# Altium schematic sheet 4.SchDoc
size 420 x 297 mm
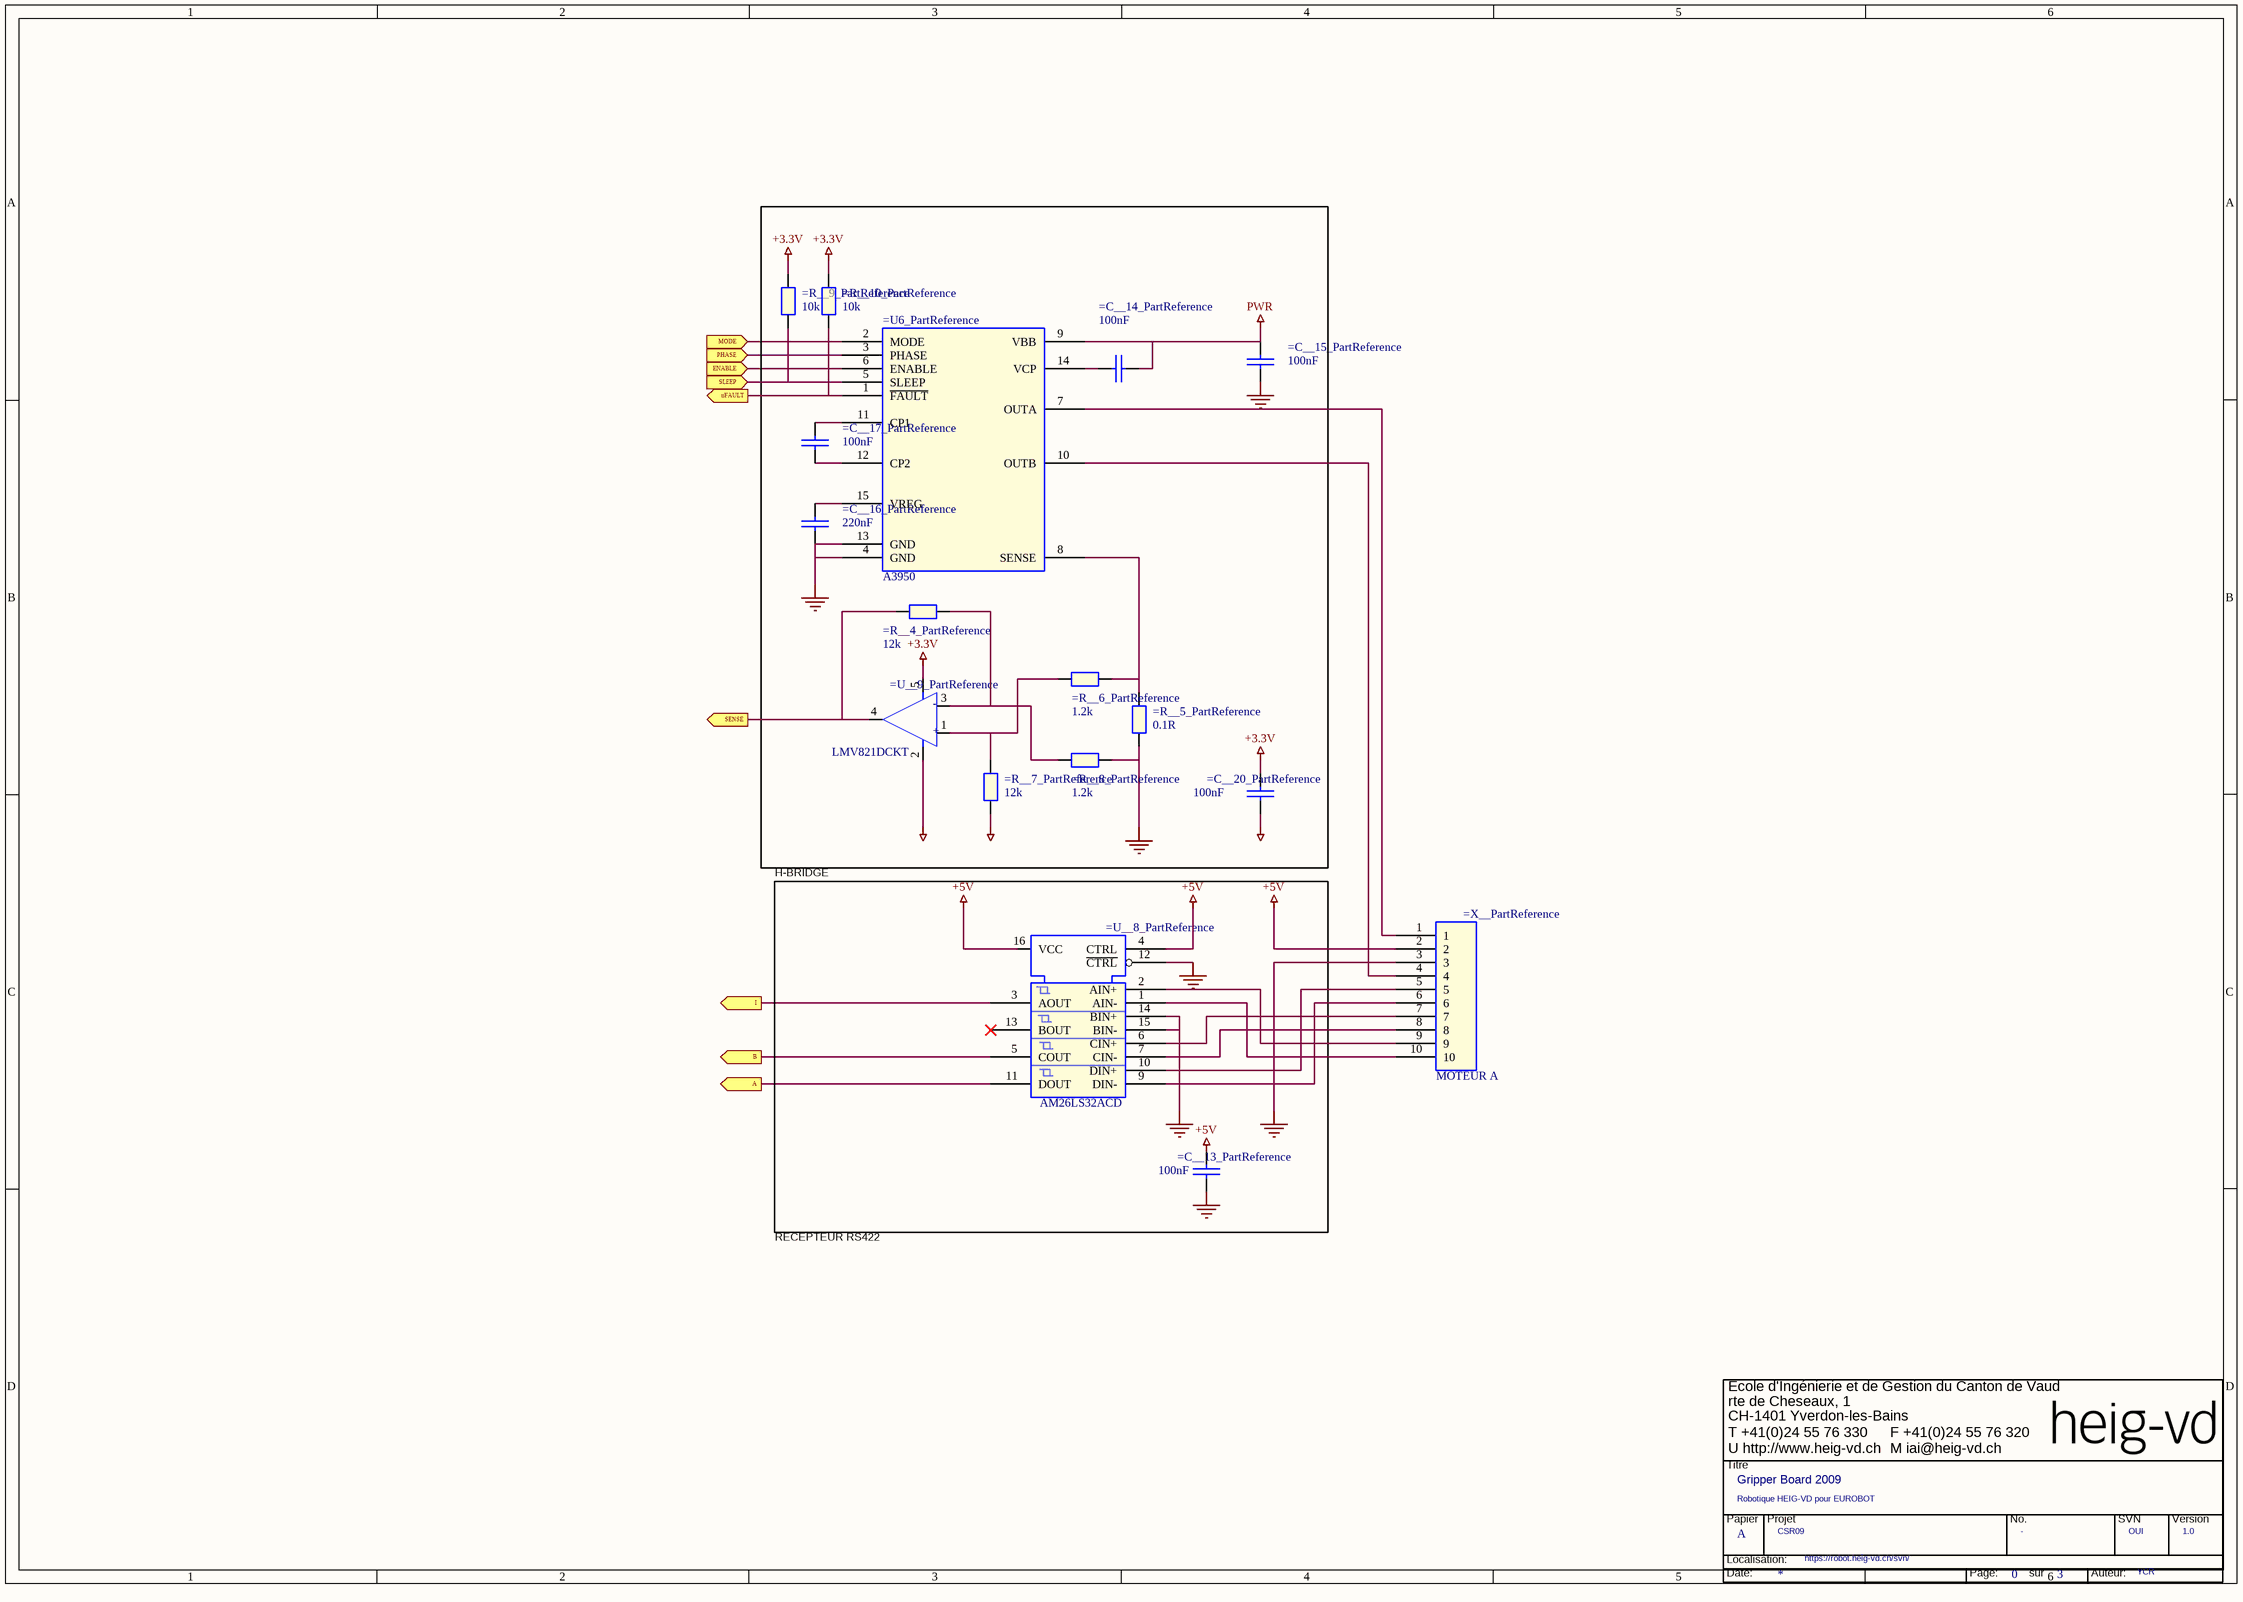
[diagram p0: 4.SchDoc]

## Parts
*  RevCode: 1.0  Title: Gripper Board 2009  Page Size: A  Page Number: 0  Page Count: 3  Projet: CSR09  Subtitle: Robotique HEIG-VD pour EUROBOT  Author: YCR  SVN: OUI  (hidden comment: TitleBlock HEIG-VD)  (graphical)
=C__13_PartReference  100nF  [SM/C_0805]
=C__14_PartReference  100nF  [SM/C_0805]
=C__15_PartReference  100nF  [SM/C_0805]
=C__16_PartReference  220nF  [SM/C_0805]
=C__17_PartReference  100nF  [SM/C_0805]
=C__20_PartReference  100nF  [SM/C_0805]
=R__4_PartReference  12k  [R400]
=R__5_PartReference  0.1R  [R400]
=R__6_PartReference  1.2k  [R400]
=R__7_PartReference  12k  [R400]
=R__8_PartReference  1.2k  [R400]
=R__9_PartReference  10k  [R400]
=R__10_PartReference  10k  [R400]
=U6_PartReference  A3950  [HEIG/SM/TSSOP16]
=U__8_PartReference  AM26LS32ACD  [HEIG/SM/SOIC16]
=U__9_PartReference  LMV821DCKT  [HEIG/SM/SC70]
=X__PartReference  MOTEUR A  [HEIG/CONN/HE10/10]

## Blocks framed on the sheet
H-BRIDGE: =C__13_PartReference =U__8_PartReference

## Ports
A (out), B (out), ENABLE (in), I (out), MODE (in), nFAULT (out), PHASE (in), SENSE (out), SLEEP (in)

## Nets
+3.3V: =C__20_PartReference.1 =R__9_PartReference.2 =R__10_PartReference.2 =U__9_PartReference.5(VCC)
+5V: =C__13_PartReference.1 =U__8_PartReference.4(CTRL) =U__8_PartReference.16(VCC) =X__PartReference.2
AGND: =C__20_PartReference.2 =R__7_PartReference.1 =U__9_PartReference.2(GND)
GND: =C__13_PartReference.2 =C__15_PartReference.2 =C__16_PartReference.2 =R__5_PartReference.1 =R__8_PartReference.1 =U6_PartReference.4(GND) =U6_PartReference.13(GND) =U__8_PartReference.8(GND) =U__8_PartReference.12(~{CTRL}) =U__8_PartReference.14(BIN+) =U__8_PartReference.15(BIN-) =X__PartReference.3
PWR: =C__14_PartReference.1 =C__15_PartReference.1 =U6_PartReference.9(VBB)
A: =U__8_PartReference.11(DOUT) ; port A
B: =U__8_PartReference.5(COUT) ; port B
ENABLE: =U6_PartReference.6(ENABLE) ; port ENABLE
I: =U__8_PartReference.3(AOUT) ; port I
MODE: =U6_PartReference.2(MODE) ; port MODE
nFAULT: =R__10_PartReference.1 =U6_PartReference.1(~{FAULT}) ; port nFAULT
PHASE: =U6_PartReference.3(PHASE) ; port PHASE
SENSE: =R__4_PartReference.2 =U__9_PartReference.4(out) ; port SENSE
SLEEP: =R__9_PartReference.1 =U6_PartReference.5(SLEEP) ; port SLEEP
Net=C__14_PartReference_2: =C__14_PartReference.2 =U6_PartReference.14(VCP)
Net=C__16_PartReference_1: =C__16_PartReference.1 =U6_PartReference.15(VREG)
Net=C__17_PartReference_1: =C__17_PartReference.1 =U6_PartReference.11(CP1)
Net=C__17_PartReference_2: =C__17_PartReference.2 =U6_PartReference.12(CP2)
Net=R__4_PartReference_1: =R__4_PartReference.1 =R__8_PartReference.2 =U__9_PartReference.3(IN-)
Net=R__5_PartReference_2: =R__5_PartReference.2 =R__6_PartReference.1 =U6_PartReference.8(SENSE)
Net=R__6_PartReference_2: =R__6_PartReference.2 =R__7_PartReference.2 =U__9_PartReference.1(IN+)
Net=U6_PartReference_7: =U6_PartReference.7(OUTA) =X__PartReference.1
Net=U6_PartReference_10: =U6_PartReference.10(OUTB) =X__PartReference.4
Net=U__8_PartReference_1: =U__8_PartReference.1(AIN-) =X__PartReference.10
Net=U__8_PartReference_2: =U__8_PartReference.2(AIN+) =X__PartReference.9
Net=U__8_PartReference_6: =U__8_PartReference.6(CIN+) =X__PartReference.7
Net=U__8_PartReference_7: =U__8_PartReference.7(CIN-) =X__PartReference.8
Net=U__8_PartReference_9: =U__8_PartReference.9(DIN-) =X__PartReference.6
Net=U__8_PartReference_10: =U__8_PartReference.10(DIN+) =X__PartReference.5

Not connected (* = marked no-connect by the designer): =U__8_PartReference 13(BOUT)*

## Notes on the sheet
- RECEPTEUR RS422
- (in symbol LMV821DCKT) -; +
- (in symbol TitleBlock HEIG-VD) Ecole d'Ingénierie et de Gestion du Canton de Vaud; rte de Cheseaux, 1; CH-1401 Yverdon-les-Bains; T +41(0)24 55 76 330; F +41(0)24 55 76 320; U http://www.heig-vd.ch; M iai@heig-vd.ch; Titre; Papier; Projet; No.; SVN; Version; Localisation:; Date:; Page:; sur; Auteur:

## Library data of the parts
* = TitleBlock HEIG-VD: OrgName: Yves Chevallier; OrgAddr1: Ecole d'Ingenierie et du Canton de Vaud; OrgAddr2: route de Cheseaux, 1; OrgAddr3: 1400 Yverdon-les-Bains; Page Create Date: March  8, 1995; No Projet: -; Location: https://robot.heig-vd.ch/svn/; Page Modify Date: *; Page_Number: =TitleBlock_3_Page_Number
=C__13_PartReference =C__17_PartReference = C_Dup1: Ref. Fabricant: PHYCOMP; Prix: 0.06; Ref. Fab: AVX; PCB Footprint: HEIG/SM/C_0805; Distributeur: Farnell; Ref. Distributeur: 432210; Distributor: Farnell; Price in €: 0.140; Ref. Distributor: 499-687
=C__14_PartReference = C_Dup1: Ref. Fabricant: AVX; Prix: 0.36; Ref. Fab: AVXMCCTA106M006.MULTICOMP; VOLTAGE: 10V; Référence: 757-720; Designation: Tantale standard; Prix Unitaire: 0.40; fab: B45196-E2225K109; PCB Footprint: HEIG/SM/C_0805; Distributeur: Farnell; Ref. Distributeur: 498660; Price in €: 0.87; Ref. Distributor: 967-014; Distributor: Farnell
=C__15_PartReference = C_Dup1: fab: B45196-E2225K109; Prix Unitaire: 0.40; Designation: Tantale standard; Référence: 757-720; VOLTAGE: 10V; Ref. Fab: AVXMCCTA106M006.MULTICOMP; Prix: 0.36; Ref. Fabricant: AVX; PCB Footprint: HEIG/SM/C_0805; Distributor: Farnell; Ref. Distributor: 967-014; Price in €: 0.87; Ref. Distributeur: 498660; Distributeur: Farnell
=C__16_PartReference =C__20_PartReference = C_Dup1: Ref. Fab: AVX; Prix: 0.06; Ref. Fabricant: PHYCOMP; PCB Footprint: HEIG/SM/C_0805; Ref. Distributor: 499-687; Price in €: 0.140; Distributor: Farnell; Ref. Distributeur: 432210; Distributeur: Farnell
=R__4_PartReference =R__7_PartReference = R_Dup3: Ref. Fabricant: MULTICOMP; Prix: 0.028; PCB Footprint: HEIG/SM/R_0805; Distributeur: Farnell
  =R__4_PartReference: Ref. Distributeur: 9331751
  =R__7_PartReference: Ref. Distributeur: 9332154
=R__5_PartReference = R_Dup3: Ref. Fabricant: MULTICOMP; Prix: 0.028; PCB Footprint: HEIG/SM/R_1206; Distributeur: Farnell; Ref. Distributeur: 9332154
=R__6_PartReference =R__8_PartReference =R__9_PartReference =R__10_PartReference = R_Dup3: Prix: 0.028; Ref. Fabricant: MULTICOMP; PCB Footprint: HEIG/SM/R_0805; Distributeur: Farnell
  =R__6_PartReference =R__8_PartReference: Ref. Distributeur: 9331751
  =R__9_PartReference =R__10_PartReference: Ref. Distributeur: 9332154
=U__8_PartReference = AM26LS32_1: Quantité min: 1; Fabricant: TEXAS INSTRUMENTS; Prix: 0.59; Ref. Fabricant: TI; Ref. Distributor: 1103045; Ref. Distributeur: 1103045; Distributeur: Farnell; PCB Footprint: HEIG/SM/SOIC16
=X__PartReference = Connecteur 10: Ref. Fab: 2-5499141-4; Ref. Fabricant: 1-828584-0; Prix: 0.94; Ref. Distributor: 1107899; Distributeur: Farnell; Ref. Distributeur: 1187838; PCB Footprint: HEIG/CONN/HE10/10
=U6_PartReference = A3950: PCB Footprint: HEIG/SM/TSSOP16
=U__9_PartReference = LMV821DCKT: PCB Footprint: HEIG/SM/SC70